# EasyEDA schematic LEDA_Arcade Controller Mainboard (No Speaker).json
TITLE: MainBoard; REV: 1.0; Date: 2019-05-25; Sheet: 1/1; Drawn By: nobody; Company: Personal
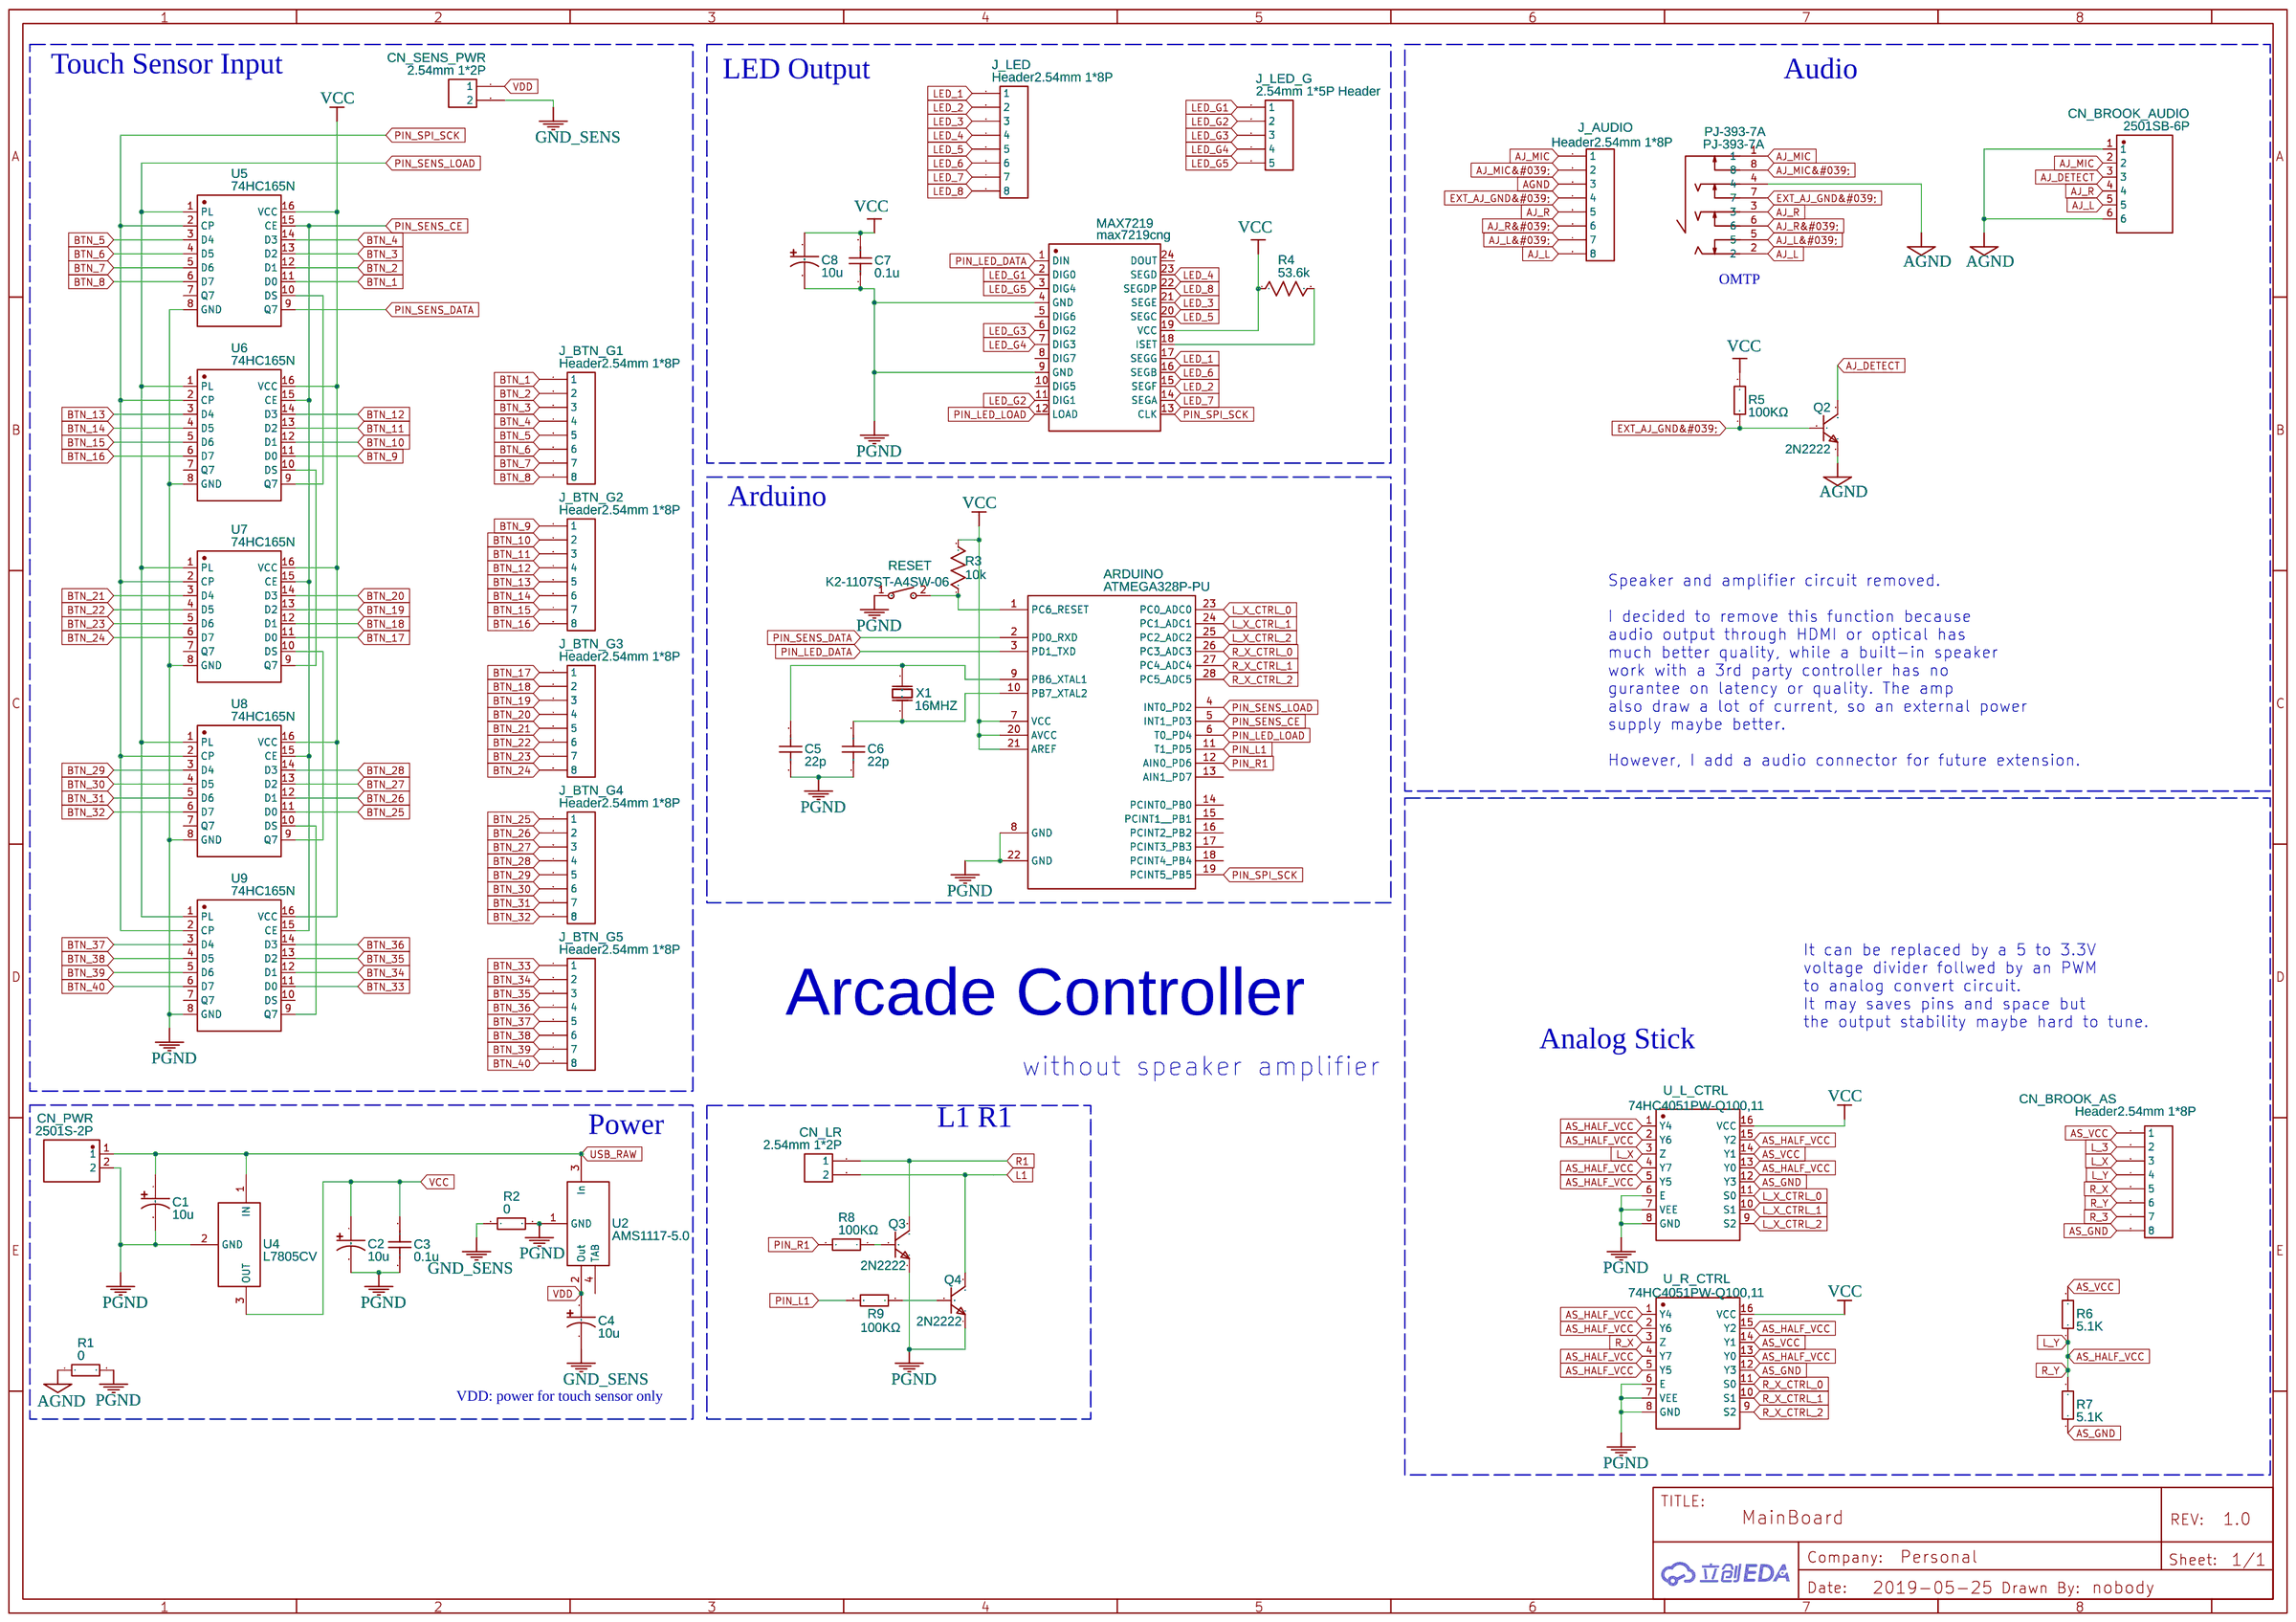
[diagram p0: schematic sheet]

## Parts
ARDUINO  ATMEGA328P-PU  [DIP-28_300MIL]
C1  10u  [CP_RADIAL_D4.0MM_P1.50MM]
C2  10u  [CP_RADIAL_D4.0MM_P1.50MM]
C3  0.1u  [CP_RADIAL_D4.0MM_P1.50MM]
C4  10u  [CP_RADIAL_D4.0MM_P1.50MM]
C5  22p  [CAP-0.2]
C6  22p  [CAP-0.2]
C7  0.1u  [CP_RADIAL_D4.0MM_P1.50MM]
C8  10u  [CP_RADIAL_D4.0MM_P1.50MM]
CN_BROOK_AS  Header2.54mm 1*8P  [HDR-8X1/2.54]
CN_BROOK_AUDIO  2501SB-6P  [2501SB-6P]
CN_LR  2.54mm 1*2P  [HDR-2X1/2.54]
CN_PWR  2501S-2P  [2501S-2P]
CN_SENS_PWR  2.54mm 1*2P  [HDR-2X1/2.54]
J_AUDIO  Header2.54mm 1*8P  [HDR-TH_8PIN-V-MALE-PITCH2.54]
J_BTN_G1  Header2.54mm 1*8P  [HDR-TH_8PIN-V-MALE-PITCH2.54]
J_BTN_G2  Header2.54mm 1*8P  [HDR-TH_8PIN-V-MALE-PITCH2.54]
J_BTN_G3  Header2.54mm 1*8P  [HDR-TH_8PIN-V-MALE-PITCH2.54]
J_BTN_G4  Header2.54mm 1*8P  [HDR-TH_8PIN-V-MALE-PITCH2.54]
J_BTN_G5  Header2.54mm 1*8P  [HDR-TH_8PIN-V-MALE-PITCH2.54]
J_LED  Header2.54mm 1*8P  [HDR-TH_8PIN-V-MALE-PITCH2.54]
J_LED_G  2.54mm 1*5P Header  [HDR-5X1/2.54]
MAX7219  max7219cng  [DIP-24_300MIL]
PJ-393-7A  PJ-393-7A  [PJ-393-7A]
Q2  2N2222  [TO-92(TO-92-3)]
Q3  2N2222  [TO-92(TO-92-3)]
Q4  2N2222  [TO-92(TO-92-3)]
R1  0  [AXIAL-0.4]
R2  0  [AXIAL-0.4]
R3  10k  [AXIAL-0.4]
R4  53.6k  [AXIAL-0.4]
R5  100KΩ  [AXIAL-0.4]
R6  5.1K  [AXIAL-0.4]
R7  5.1K  [AXIAL-0.4]
R8  100KΩ  [AXIAL-0.4]
R9  100KΩ  [AXIAL-0.4]
RESET  K2-1107ST-A4SW-06  [K2-1107ST-A4SW-06]
U2  AMS1117-5.0  [SOT-223]
U4  L7805CV  [TO-220(TO-220-3)]
U5  74HC165N  [DIP16]
U6  74HC165N  [DIP16]
U7  74HC165N  [DIP16]
U8  74HC165N  [DIP16]
U9  74HC165N  [DIP16]
U_L_CTRL  74HC4051PW-Q100,11  [TSSOP-16]
U_R_CTRL  74HC4051PW-Q100,11  [TSSOP-16]
X1  16MHZ  [HC-49S]

## Library data of the parts
ARDUINO = -: sourceId: Oic6oiASL; Supplier: LCSC; Manufacturer: MICROCHIP; image: //image.lceda.cn/szlcsc/C33901.jpg; Contributor: LCSC; Supplier Part: C33901
C1 C2 C4 C8 = Cap_Electrolytic(TH)_D4.0XF1.5_US: Manufacturer Part: ?
C3 C7 = Cap_RAD-0.2_US: Manufacturer Part: ?
C5 C6 = Cap_0603_US: Manufacturer Part: ?
CN_BROOK_AS J_AUDIO J_BTN_G1-J_BTN_G5 J_LED = -: Supplier Part: C49256; Supplier: LCSC; Manufacturer: ReliaPro; image: http://image.lceda.cn/szlcsc/C49256.jpg
CN_BROOK_AUDIO = -: Supplier: LCSC; Supplier Part: C132455; Manufacturer: Shenzhen Cankemeng; Contributor: LCSC
CN_LR CN_SENS_PWR = -: Supplier: LCSC; Manufacturer: ReliaPro; image: http://image.lceda.cn/szlcsc/C36717.jpg; Supplier Part: C36717
CN_PWR = -: Supplier: LCSC; Supplier Part: C168996; Manufacturer: Shenzhen Cankemeng; Contributor: LCSC
J_LED_G = -: Supplier Part: C50951; Supplier: LCSC; Manufacturer: ReliaPro; image: http://image.lceda.cn/szlcsc/C50951.jpg
MAX7219 = -: Supplier: LCSC; Manufacturer: MAXIM; image: //image.lceda.cn/szlcsc/C29160.jpg; Supplier Part: C29160
PJ-393-7A = -: Supplier: LCSC; Manufacturer: HRO; Supplier Part: C128990; Package Display: No
Q2-Q4 = -: Supplier: LCSC; Manufacturer: SEMTECH; Contributor: LCSC; Supplier Part: C118536
R1 R2 = CF1/4W-0Ω±5% T52: Supplier: LCSC; Supplier Part: C119982; Manufacturer: Chian Chia Elec; Contributor: LCSC
R3 R4 = Res_0603(1/10W)_US: Manufacturer Part: ?
R5 R8 R9 = MFR0W4F1002A50: Supplier: LCSC; Manufacturer: UniOhm; Supplier Part: C57436
R6 R7 = MF1/4W-5.1KΩ±1% T52: Supplier: LCSC; Supplier Part: C119340; Manufacturer: Chian Chia Elec; Contributor: LCSC
RESET = -: Supplier: LCSC; Supplier Part: C118141; Manufacturer: Rectangular Connectors - Contacts; Contributor: LCSC
U2 = -: sourceId: HltLFyQwq; Supplier: LCSC; Manufacturer: AMS; LCSC Assembly: Yes; image: //image.lceda.cn/szlcsc/C6187.jpg; Supplier Part: C6187; SMT Type: Basic
U4 = -: Supplier: LCSC; Manufacturer: STMicroelectronics; Supplier Part: C111887
U5-U9 = -: Manufacturer Part: ?
U_L_CTRL U_R_CTRL = -: Supplier: LCSC; Manufacturer: Nexperia; Contributor: LCSC; Supplier Part: C179325
X1 = X49SD16MSD2SI: Supplier: LCSC; Supplier Part: C188201; Manufacturer: Yangxing Tech; Contributor: LCSC

## Nets
AGND: CN_BROOK_AUDIO.1 CN_BROOK_AUDIO.6 J_AUDIO.3 PJ-393-7A.4 Q2.1(E) R1.1
GND_SENS: C4.2 CN_SENS_PWR.2 R2.1
PGND: ARDUINO.8(GND) ARDUINO.22(GND) C1.2 C2.2 C3.1 C5.1 C6.1 C7.1 C8.2 CN_PWR.2 MAX7219.4(GND) MAX7219.9(GND) Q3.1(E) Q4.1(E) R1.2 R2.2 RESET.1 U2.1(GND) U4.2(GND) U5.8(GND) U6.8(GND) U7.8(GND) U8.8(GND) U9.8(GND) U_L_CTRL.6(E) U_L_CTRL.7(VEE) U_L_CTRL.8(GND) U_R_CTRL.6(E) U_R_CTRL.7(VEE) U_R_CTRL.8(GND)
VCC: ARDUINO.7(VCC) ARDUINO.20(AVCC) ARDUINO.21(AREF) C2.1 C3.2 C7.2 C8.1 MAX7219.19(VCC) R3.2 R4.1 R5.2 U4.3(OUT) U5.16(VCC) U6.16(VCC) U7.16(VCC) U8.16(VCC) U9.16(VCC) U_L_CTRL.16(VCC) U_R_CTRL.16(VCC)
VDD: C4.1 CN_SENS_PWR.1 U2.2(Out)
AJ_DETECT: CN_BROOK_AUDIO.3 Q2.3(C)
AJ_L: CN_BROOK_AUDIO.5 J_AUDIO.8 PJ-393-7A.2
AJ_L&#039;: J_AUDIO.7 PJ-393-7A.5
AJ_MIC: CN_BROOK_AUDIO.2 J_AUDIO.1 PJ-393-7A.1
AJ_MIC&#039;: J_AUDIO.2 PJ-393-7A.8
AJ_R: CN_BROOK_AUDIO.4 J_AUDIO.5 PJ-393-7A.3
AJ_R&#039;: J_AUDIO.6 PJ-393-7A.6
AS_GND: CN_BROOK_AS.8 R7.1 U_L_CTRL.12(Y3) U_R_CTRL.12(Y3)
AS_HALF_VCC: CN_BROOK_AS.4 CN_BROOK_AS.6 R6.1 R7.2 U_L_CTRL.1(Y4) U_L_CTRL.2(Y6) U_L_CTRL.4(Y7) U_L_CTRL.5(Y5) U_L_CTRL.13(Y0) U_L_CTRL.15(Y2) U_R_CTRL.1(Y4) U_R_CTRL.2(Y6) U_R_CTRL.4(Y7) U_R_CTRL.5(Y5) U_R_CTRL.13(Y0) U_R_CTRL.15(Y2)
AS_VCC: CN_BROOK_AS.1 R6.2 U_L_CTRL.14(Y1) U_R_CTRL.14(Y1)
BTN_1: J_BTN_G1.1 U5.11(D0)
BTN_2: J_BTN_G1.2 U5.12(D1)
BTN_3: J_BTN_G1.3 U5.13(D2)
BTN_4: J_BTN_G1.4 U5.14(D3)
BTN_5: J_BTN_G1.5 U5.3(D4)
BTN_6: J_BTN_G1.6 U5.4(D5)
BTN_7: J_BTN_G1.7 U5.5(D6)
BTN_8: J_BTN_G1.8 U5.6(D7)
BTN_9: J_BTN_G2.1 U6.11(D0)
BTN_10: J_BTN_G2.2 U6.12(D1)
BTN_11: J_BTN_G2.3 U6.13(D2)
BTN_12: J_BTN_G2.4 U6.14(D3)
BTN_13: J_BTN_G2.5 U6.3(D4)
BTN_14: J_BTN_G2.6 U6.4(D5)
BTN_15: J_BTN_G2.7 U6.5(D6)
BTN_16: J_BTN_G2.8 U6.6(D7)
BTN_17: J_BTN_G3.1 U7.11(D0)
BTN_18: J_BTN_G3.2 U7.12(D1)
BTN_19: J_BTN_G3.3 U7.13(D2)
BTN_20: J_BTN_G3.4 U7.14(D3)
BTN_21: J_BTN_G3.5 U7.3(D4)
BTN_22: J_BTN_G3.6 U7.4(D5)
BTN_23: J_BTN_G3.7 U7.5(D6)
BTN_24: J_BTN_G3.8 U7.6(D7)
BTN_25: J_BTN_G4.1 U8.11(D0)
BTN_26: J_BTN_G4.2 U8.12(D1)
BTN_27: J_BTN_G4.3 U8.13(D2)
BTN_28: J_BTN_G4.4 U8.14(D3)
BTN_29: J_BTN_G4.5 U8.3(D4)
BTN_30: J_BTN_G4.6 U8.4(D5)
BTN_31: J_BTN_G4.7 U8.5(D6)
BTN_32: J_BTN_G4.8 U8.6(D7)
BTN_33: J_BTN_G5.1 U9.11(D0)
BTN_34: J_BTN_G5.2 U9.12(D1)
BTN_35: J_BTN_G5.3 U9.13(D2)
BTN_36: J_BTN_G5.4 U9.14(D3)
BTN_37: J_BTN_G5.5 U9.3(D4)
BTN_38: J_BTN_G5.6 U9.4(D5)
BTN_39: J_BTN_G5.7 U9.5(D6)
BTN_40: J_BTN_G5.8 U9.6(D7)
EXT_AJ_GND&#039;: J_AUDIO.4 PJ-393-7A.7 Q2.2(B) R5.1
L1: CN_LR.2 Q4.3(C)
L_3: CN_BROOK_AS.2
L_X: CN_BROOK_AS.3 U_L_CTRL.3(Z)
L_X_CTRL_0: ARDUINO.23(PC0 ADC0) U_L_CTRL.11(S0)
L_X_CTRL_1: ARDUINO.24(PC1 ADC1) U_L_CTRL.10(S1)
L_X_CTRL_2: ARDUINO.25(PC2 ADC2) U_L_CTRL.9(S2)
LED_1: J_LED.1 MAX7219.17(SEGG)
LED_2: J_LED.2 MAX7219.15(SEGF)
LED_3: J_LED.3 MAX7219.21(SEGE)
LED_4: J_LED.4 MAX7219.23(SEGD)
LED_5: J_LED.5 MAX7219.20(SEGC)
LED_6: J_LED.6 MAX7219.16(SEGB)
LED_7: J_LED.7 MAX7219.14(SEGA)
LED_8: J_LED.8 MAX7219.22(SEGDP)
LED_G1: J_LED_G.1 MAX7219.2(DIG0)
LED_G2: J_LED_G.2 MAX7219.11(DIG1)
LED_G3: J_LED_G.3 MAX7219.6(DIG2)
LED_G4: J_LED_G.4 MAX7219.7(DIG3)
LED_G5: J_LED_G.5 MAX7219.3(DIG4)
PIN_L1: ARDUINO.11(T1 PD5) R9.2
PIN_LED_DATA: ARDUINO.3(PD1 TXD) MAX7219.1(DIN)
PIN_LED_LOAD: ARDUINO.6(T0 PD4) MAX7219.12(LOAD)
PIN_R1: ARDUINO.12(AIN0 PD6) R8.2
PIN_SENS_CE: ARDUINO.5(INT1 PD3) U5.15(CE) U6.15(CE) U7.15(CE) U8.15(CE) U9.15(CE)
PIN_SENS_DATA: ARDUINO.2(PD0 RXD) U5.9(Q7)
PIN_SENS_LOAD: ARDUINO.4(INT0 PD2) U5.1(PL) U6.1(PL) U7.1(PL) U8.1(PL) U9.1(PL)
PIN_SPI_SCK: ARDUINO.19(PCINT5 PB5) MAX7219.13(CLK) U5.2(CP) U6.2(CP) U7.2(CP) U8.2(CP) U9.2(CP)
R1: CN_LR.1 Q3.3(C)
R_3: CN_BROOK_AS.7
R_X: CN_BROOK_AS.5 U_R_CTRL.3(Z)
R_X_CTRL_0: ARDUINO.26(PC3 ADC3) U_R_CTRL.11(S0)
R_X_CTRL_1: ARDUINO.27(PC4 ADC4) U_R_CTRL.10(S1)
R_X_CTRL_2: ARDUINO.28(PC5 ADC5) U_R_CTRL.9(S2)
USB_RAW: C1.1 CN_PWR.1 U2.3(In) U4.1(IN)
ARDUINO_1: ARDUINO.1(PC6 RESET) R3.1 RESET.2
ARDUINO_9: ARDUINO.9(PB6 XTAL1) C5.2 X1.1(OSC1)
ARDUINO_10: ARDUINO.10(PB7 XTAL2) C6.2 X1.2(OSC2)
MAX7219_18: MAX7219.18(ISET) R4.2
Q3_2: Q3.2(B) R8.1
Q4_2: Q4.2(B) R9.1
U5_10: U5.10(DS) U6.9(Q7)
U6_10: U6.10(DS) U7.9(Q7)
U7_10: U7.10(DS) U8.9(Q7)
U8_10: U8.10(DS) U9.9(Q7)

Not connected (* = marked no-connect by the designer): ARDUINO 13(AIN1 PD7) 14(PCINT0 PB0) 15(PCINT1  PB1) 16(PCINT2 PB2) 17(PCINT3 PB3) 18(PCINT4 PB4); MAX7219 5(DIG6) 8(DIG7) 10(DIG5) 24(DOUT); U2 4(TAB); U5 7(Q7); U6 7(Q7); U7 7(Q7); U8 7(Q7); U9 7(Q7) 10(DS)

## Notes on the sheet
- Touch Sensor Input
- LED Output
- Audio
- OMTP
- Arduino
- Speaker and amplifier circuit removed.
  I decided to remove this function because
  audio output through HDMI or optical has
  much better quality, while a built-in speaker
  work with a 3rd party controller has no
  gurantee on latency or quality. The amp
  also draw a lot of current, so an external power
  supply maybe better.
  However, I add a audio connector for future extension.
- It can be replaced by a 5 to 3.3V
  voltage divider follwed by an PWM
  to analog convert circuit.
  It may saves pins and space but
  the output stability maybe hard to tune.
- Arcade Controller
- Analog Stick
- without speaker amplifier
- Power
- L1 R1
- VDD: power for touch sensor only
